# Altium schematic sheet powertrain.SchDoc: SION Power Train
size A4; Organization: UNSW Solar Racing Team; Address3: UNSW; Address4: Sydney NSW 2052; Address2: Electrical Engineering; Address1: Rm 342
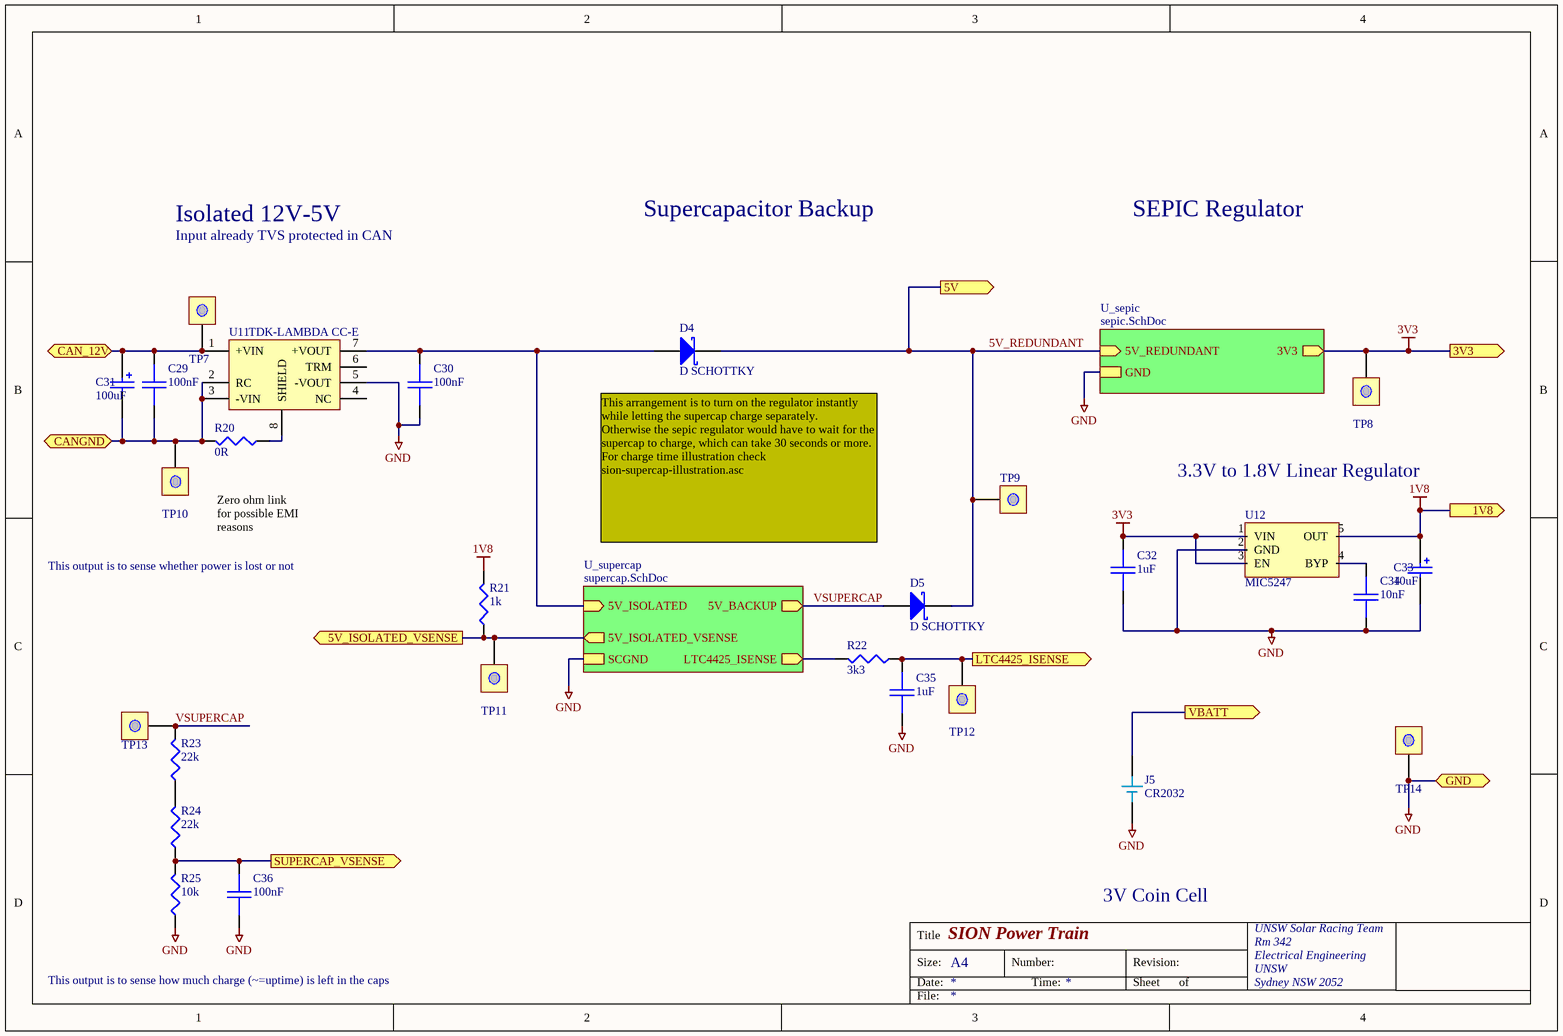
[diagram p0: powertrain.SchDoc]

## Parts
C29  100nF  [0603]
C30  100nF  [0603]
C31  100uF  [MCCT-CASEA]
C32  1uF  [0805]
C33  10uF  [MCCT-CASEA]
C34  10nF  [0603]
C35  1uF  [0805]
C36  100nF  [0603]
D4  D SCHOTTKY  [DIODE-D1.5mm]
D5  D SCHOTTKY  [DIODE-D1.5mm]
J5  CR2032  [CR2032_VERTICAL]
R20  0R  [1206]
R21  1k  [0603]
R22  3k3  [0603]
R23  22k  [0805]
R24  22k  [0805]
R25  10k  [0805]
TP7  CAN12V  [TESTPOINT]  (value not drawn)
TP8  3V3  [TESTPOINT]  (value not drawn)
TP9  5V  [TESTPOINT]  (value not drawn)
TP10  CANGND  [TESTPOINT]  (value not drawn)
TP11  VSENSE  [TESTPOINT]  (value not drawn)
TP12  ISENSE  [TESTPOINT]  (value not drawn)
TP13  VCAP  [TESTPOINT]  (value not drawn)
TP14  GND  [TESTPOINT]  (value not drawn)
U11  TDK-LAMBDA CC-E  [CC10-F-E]
U12  MIC5247  [SOT23-5]

## Sub-sheets
U_sepic = sepic.SchDoc: 3V3 (out), 5V_REDUNDANT (in), GND
U_supercap = supercap.SchDoc: LTC4425_ISENSE (out), 5V_ISOLATED (in), 5V_BACKUP (out), SCGND, 5V_ISOLATED_VSENSE (out)

## Ports
1V8 (out), 3V3 (out), 5V (out), 5V_ISOLATED_VSENSE (out), CAN_12V, CANGND, GND, LTC4425_ISENSE (out), SUPERCAP_VSENSE (out), VBATT (out)

## Nets
1V8: C33.1 R21.2 U12.5(OUT) ; port 1V8
3V3: C32.1 TP8.0(TP) U12.1(VIN) U12.3(EN) ; port 3V3, sheet U_sepic/3V3
GND: C30.2 C32.2 C33.2 C34.2 C35.2 C36.2 J5.2 R25.1 TP14.0(TP) U11.5(-VOUT) U12.2(GND) ; port GND, sheet U_supercap/SCGND, sheet U_sepic/GND
5V_ISOLATED_VSENSE: R21.1 TP11.0(TP) ; port 5V_ISOLATED_VSENSE, sheet U_supercap/5V_ISOLATED_VSENSE
5V_REDUNDANT: D4.K D5.K TP9.0(TP) ; port 5V, sheet U_sepic/5V_REDUNDANT
CAN_12V: C29.1 C31.1 TP7.0(TP) U11.1(+VIN) ; port CAN_12V
CANGND: C29.2 C31.2 R20.2 TP10.0(TP) U11.2(RC) U11.3(-VIN) ; port CANGND
LTC4425_ISENSE: C35.1 R22.1 TP12.0(TP) ; port LTC4425_ISENSE
SUPERCAP_VSENSE: C36.1 R24.1 R25.2 ; port SUPERCAP_VSENSE
VBATT: J5.1(3V) ; port VBATT
VSUPERCAP: D5.A R23.2 TP13.0(TP) ; sheet U_supercap/5V_BACKUP
NetC30_1: C30.1 D4.A U11.7(+VOUT) ; sheet U_supercap/5V_ISOLATED
NetC34_1: C34.1 U12.4(BYP)
NetR20_1: R20.1 U11.8(SHIELD)
NetR22_2: R22.2 ; sheet U_supercap/LTC4425_ISENSE
NetR23_1: R23.1 R24.2

Not connected (* = marked no-connect by the designer): U11 4(NC) 6(TRM)

## Notes on the sheet
- Isolated 12V-5V
- Input already TVS protected in CAN
- Supercapacitor Backup
- SEPIC Regulator
- 3.3V to 1.8V Linear Regulator
- This output is to sense whether power is lost or not
- Zero ohm link
  for possible EMI reasons
- (near D4) This arrangement is to turn on the regulator instantly while letting the supercap charge separately.
  Otherwise the sepic regulator would have to wait for the supercap to charge, which can take 30 seconds or more.
  For charge time illustration check sion-supercap-illustration.asc
- 3V Coin Cell
- This output is to sense how much charge (~=uptime) is left in the caps
- Title
- Size:
- Date:
- A4
- Number:
- Time:
- Revision:
- Sheet
- of
- File:

## Library data of the parts
C29 C30 C32 C34-C36 = CAP: Capacitor
C31 C33 = CAP POL3: Polarized Capacitor (Surface Mount); Revision: July-2002: Re-released for DXP Platform.
  C31: Digikey: 495-2256-1-ND; DigikeyPrice: 1.24; Farnell: 1658601; FarnellPrice: 2.64
  C33: Digikey: 399-3687-1-ND; DigikeyPrice: 0.54; Farnell: 1650980; FarnellPrice: 0.786
D4 D5 = D SCHOTTKY: Schottky Diode; RS: 3954196; Revision: July-2002: Re-released for DXP Platform.; Digikey: 95SQ015-ND; DigikeyPrice: 3.36; Farnell: 506795; FarnellPrice: 8.61
J5 = CR2032: Battery Coin CR2032 3V; Farnell: 1216359; Farnellprice: 3.97
R20-R25 = RES1: Resistor
  R23 R24: Digikey: P22KDACT-ND; DigikeyPrice: 0.54; Farnell: 9370986; FarnellPrice: 0.04
  R25: Farnell: 1612522; FarnellPrice: 0.022; Digikey: P10.0KCCT-ND; DigikeyPrice: 0.07
TP7-TP14 = TEST: TEST POINT
U11 = CC10-F-E: Isolated DC-DC Converter; Digikey: 445-2435-ND; Farnell: 1547717; FarnellPrice: 56.78; DigikeyPrice: 26.66
U12 = MIC5247: 150mA Low-Voltage Linear Regulator; Digikey: 576-1288-1-ND; DigikeyPrice: 1.08